# EAGLE schematic Motor control template (EAGLE 6.4)
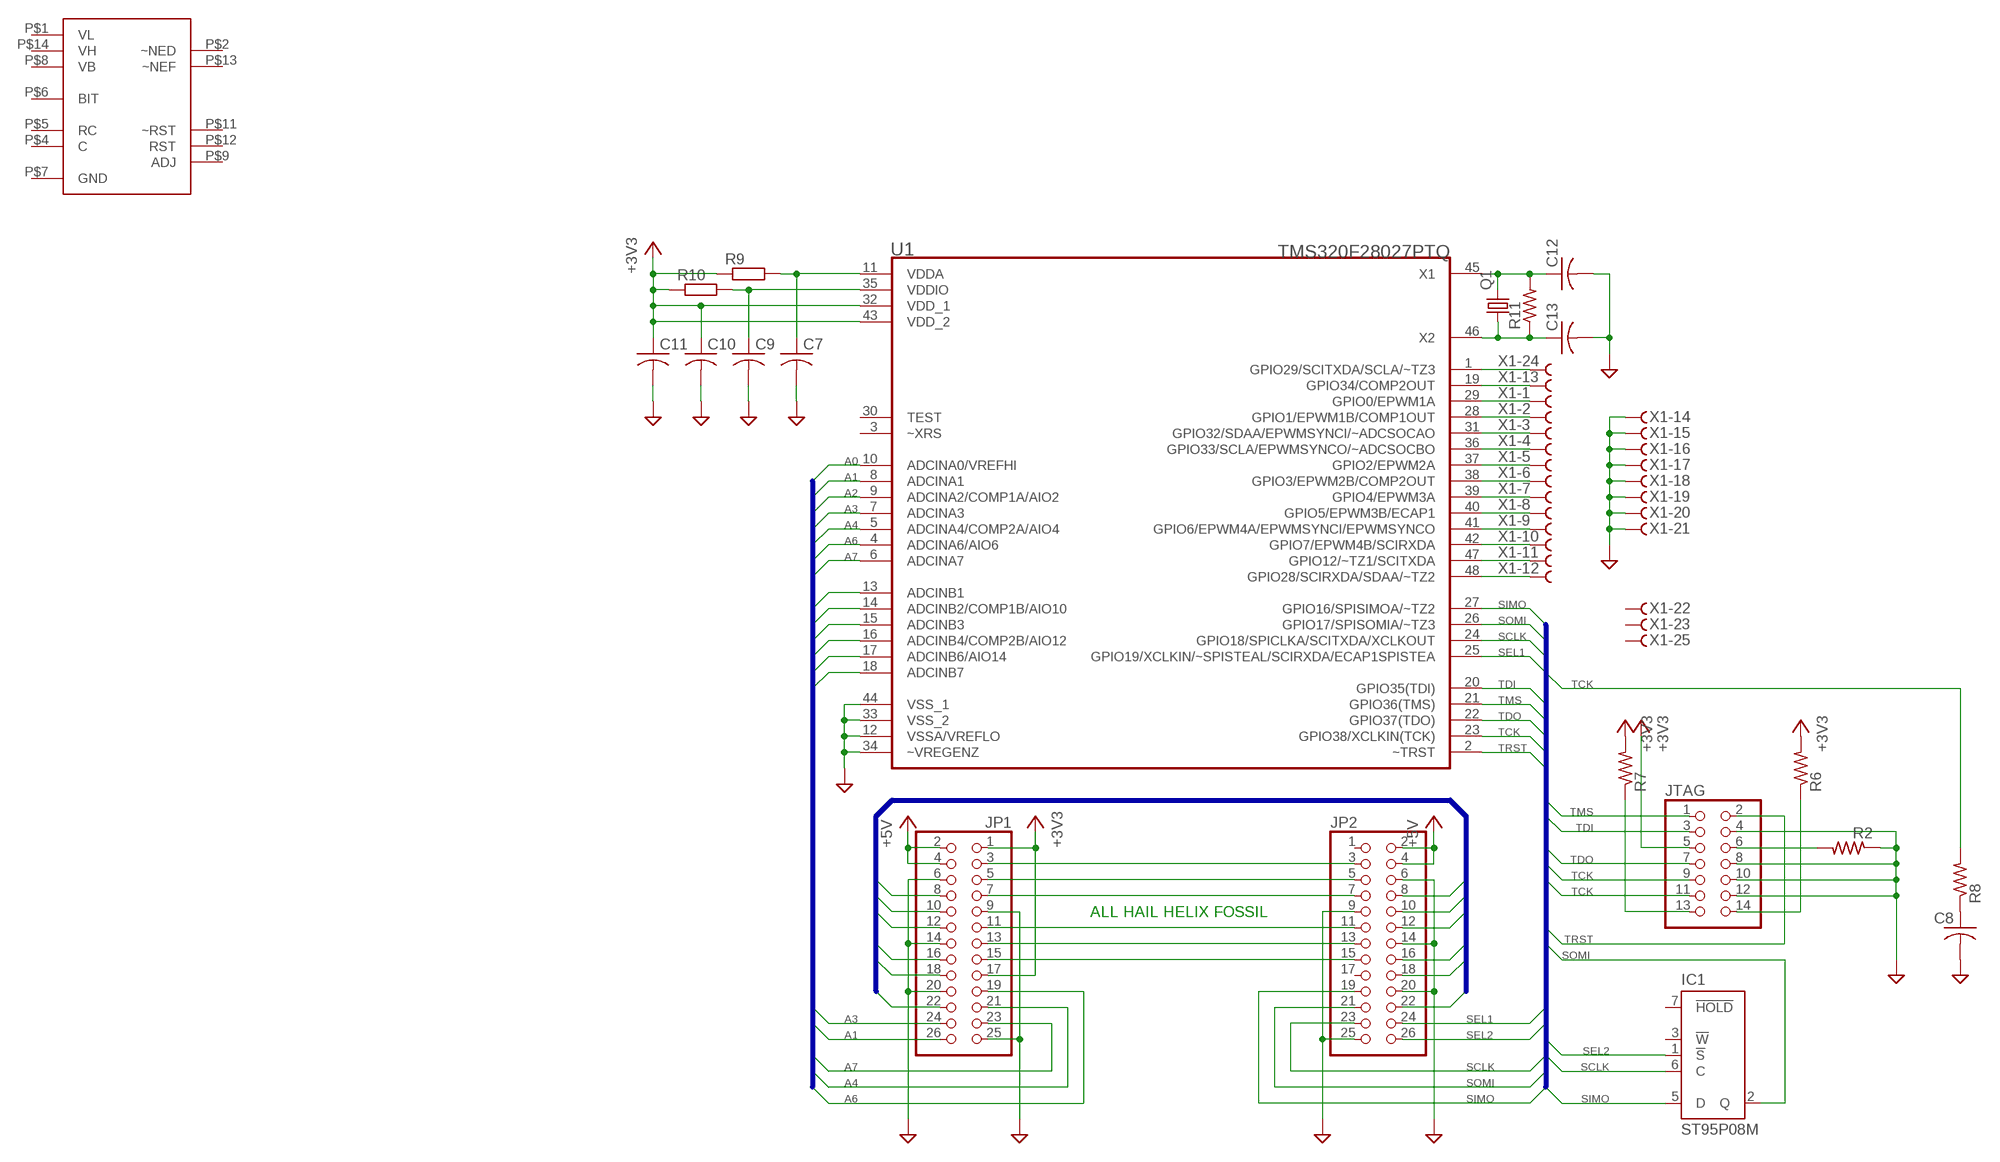
[diagram p0: schematic, sheet 1]

## Parts
C7  C-USC0805  [C0805]
C8  C-USC0805  [C0805]
C9  C-USC0805  [C0805]
C10  C-USC0805  [C0805]
C11  C-USC0805  [C0805]
C12  C-USC0805  [C0805]
C13  C-USC0805  [C0805]
IC1  ST95P08M  [SO08]
JP1  PINHD-2X13  [2X13]
JP2  PINHD-2X13  [2X13]
JTAG  PINHD-2X7  [2X07]
Q1  CRYSTALHC49UP  [HC49UP]
R2  R-US_M0805  [M0805]
R6  R-US_M0805  [M0805]
R7  R-US_M0805  [M0805]
R8  R-US_M0805  [M0805]
R9  R-EU_R0805  [R0805]
R10  R-EU_R0805  [R0805]
R11  R-US_M0805  [M0805]
U1  TMS320F28027PTQ  [QFP50P900X900X160-48N]
U$1  HSN1000  [HSN1000L]
X1  D-SUB25-H2M25ST  [H2M25ST]

## Nets
+3V3: C10.1 C11.1 JP1.1 JP1.17 JTAG.5 R6.2 R7.2 R9.1 R10.1
+5V: JP1.2 JP1.4 JP2.2 JP2.4
A1: JP1.26
A3: JP1.24
A4: JP1.21
A6: JP1.19
A7: JP1.23
DGND: C7.2 C8.2 C9.2 C10.2 C11.2 C12.2 C13.2 JP1.6 JP1.9 JP1.14 JP1.20 JP1.25 JP2.6 JP2.9 JP2.14 JP2.20 JP2.25 JTAG.4 JTAG.8 JTAG.10 JTAG.12 R2.1 X1.14 X1.15 X1.16 X1.17 X1.18 X1.19 X1.20 X1.21
GPIO0: JP1.22 JP2.22
GPIO1: JP1.18 JP2.18
GPIO2: JP1.16 JP2.16
GPIO3: JP1.12 JP2.12
GPIO4: JP1.10 JP2.10
GPIO5: JP1.8 JP2.8
N$1: U1.29(GPIO0/EPWM1A) X1.1
N$2: U1.28(GPIO1/EPWM1B/COMP1OUT) X1.2
N$3: U1.31(GPIO32/SDAA/EPWMSYNCI/~ADCSOCAO) X1.3
N$4: U1.36(GPIO33/SCLA/EPWMSYNCO/~ADCSOCBO) X1.4
N$5: JTAG.14 R6.1
N$6: JTAG.6 R2.2
N$7: U1.37(GPIO2/EPWM2A) X1.5
N$8: U1.38(GPIO3/EPWM2B/COMP2OUT) X1.6
N$9: U1.39(GPIO4/EPWM3A) X1.7
N$10: U1.40(GPIO5/EPWM3B/ECAP1) X1.8
N$11: U1.41(GPIO6/EPWM4A/EPWMSYNCI/EPWMSYNCO) X1.9
N$12: C8.1 R8.1
N$13: JTAG.13 R7.1
N$14: C7.1 R9.2
N$15: C9.1 R10.2
N$16: U1.42(GPIO7/EPWM4B/SCIRXDA) X1.10
N$17: U1.47(GPIO12/~TZ1/SCITXDA) X1.11
N$18: U1.48(GPIO28/SCIRXDA/SDAA/~TZ2) X1.12
N$19: U1.1(GPIO29/SCITXDA/SCLA/~TZ3) X1.24
N$20: U1.19(GPIO34/COMP2OUT) X1.13
N$21: C12.1 Q1.2 R11.2 U1.45(X1)
N$22: C13.1 Q1.1 R11.1 U1.46(X2)
N$23: JP1.3 JP2.3
N$24: JP1.5 JP2.5
N$25: JP1.7 JP2.7
N$26: JP1.11 JP2.11
N$27: JP1.13 JP2.13
N$28: JP1.15 JP2.15
SCLK: IC1.6(C) JP2.23 U1.24(GPIO18/SPICLKA/SCITXDA/XCLKOUT)
SEL1: JP2.24 U1.25(GPIO19/XCLKIN/~SPISTEAL/SCIRXDA/ECAP1SPISTEA)
SEL2: IC1.1(!S) JP2.26
SIMO: IC1.5(D) JP2.19 U1.27(GPIO16/SPISIMOA/~TZ2)
SOMI: IC1.2(Q) JP2.21 U1.26(GPIO17/SPISOMIA/~TZ3)
TCK: JTAG.9 JTAG.11 R8.2 U1.23(GPIO38/XCLKIN(TCK))
TDI: JTAG.3 U1.20(GPIO35(TDI))
TDO: JTAG.7 U1.22(GPIO37(TDO))
TMS: JTAG.1 U1.21(GPIO36(TMS))
TRST: JTAG.2 U1.2(~TRST)
Unconnected: IC1.3(!W) IC1.7(!HOLD) JP2.1 JP2.17 U1.3(~XRS) U1.4(ADCINA6/AIO6) U1.5(ADCINA4/COMP2A/AIO4) U1.6(ADCINA7) U1.7(ADCINA3) U1.8(ADCINA1) U1.9(ADCINA2/COMP1A/AIO2) U1.10(ADCINA0/VREFHI) U1.12(VSSA/VREFLO) U1.13(ADCINB1) U1.14(ADCINB2/COMP1B/AIO10) U1.15(ADCINB3) U1.16(ADCINB4/COMP2B/AIO12) U1.17(ADCINB6/AIO14) U1.18(ADCINB7) U1.30(TEST) U1.33(VSS_2) U1.34(~VREGENZ) U1.43(VDD_2) U$1.P$2(~NED) U$1.P$4(C) U$1.P$5(RC) U$1.P$6(BIT) U$1.P$9(ADJ) U$1.P$11(~RST) U$1.P$12(RST) U$1.P$13(~NEF) X1.22 X1.23 X1.25

## Buses
TDI,TMS,TDO,TCK,TRST,SIMO,SOMI,SCLK,SEL1,SEL2
A[0..7],B[0..7]
GPIO[0..8]

## Notes on the sheet
- ALL HAIL HELIX FOSSIL

## Power pins joined to a net without a drawn wire
GND: IC1.4(GND) U$1.P$7(GND)
VB: U$1.P$8(VB)
VCC: IC1.8(VCC)
VDD_1: U1.32(VDD_1)
VDDA: U1.11(VDDA)
VDDIO: U1.35(VDDIO)
VH: U$1.P$14(VH)
VL: U$1.P$1(VL)
VSS_1: U1.44(VSS_1)

## Library data of the parts
C7-C13 = resistor:C-US: CAPACITOR, American symbol
IC1 = st-microelectronics:ST95P08M: Serial EEPROM SPI bus, 1 K x 8; OC_FARNELL: unknown; OC_NEWARK: unknown
JP1 JP2 = pinhead:PINHD-2X13: PIN HEADER
JTAG = pinhead:PINHD-2X7: PIN HEADER
Q1 = crystal:CRYSTAL: CRYSTAL; OC_FARNELL: unknown; OC_NEWARK: unknown
R2 R6-R8 R11 = rcl:R-US_: RESISTOR, American symbol
R9 R10 = rcl:R-EU_: RESISTOR, European symbol
U1 = Texas Instruments_By_element14_Batch_1:TMS320F28027PTQ: Piccolo Microcontrollers; MPN: TMS320F28027PTQ; OC_FARNELL: -; OC_NEWARK: 55R7504; PACKAGE: PQFP-48; SUPPLIER: Texas Instruments
U$1 = RaspberryPi:HSN1000
X1 = con-thomas-betts:D-SUB25-: D-Subminiatur Connector Source: Electronioc Interconnects European Edition 1998; OC_FARNELL: unknown; OC_NEWARK: unknown